# EAGLE schematic LA_16CH (EAGLE 9.2.1)
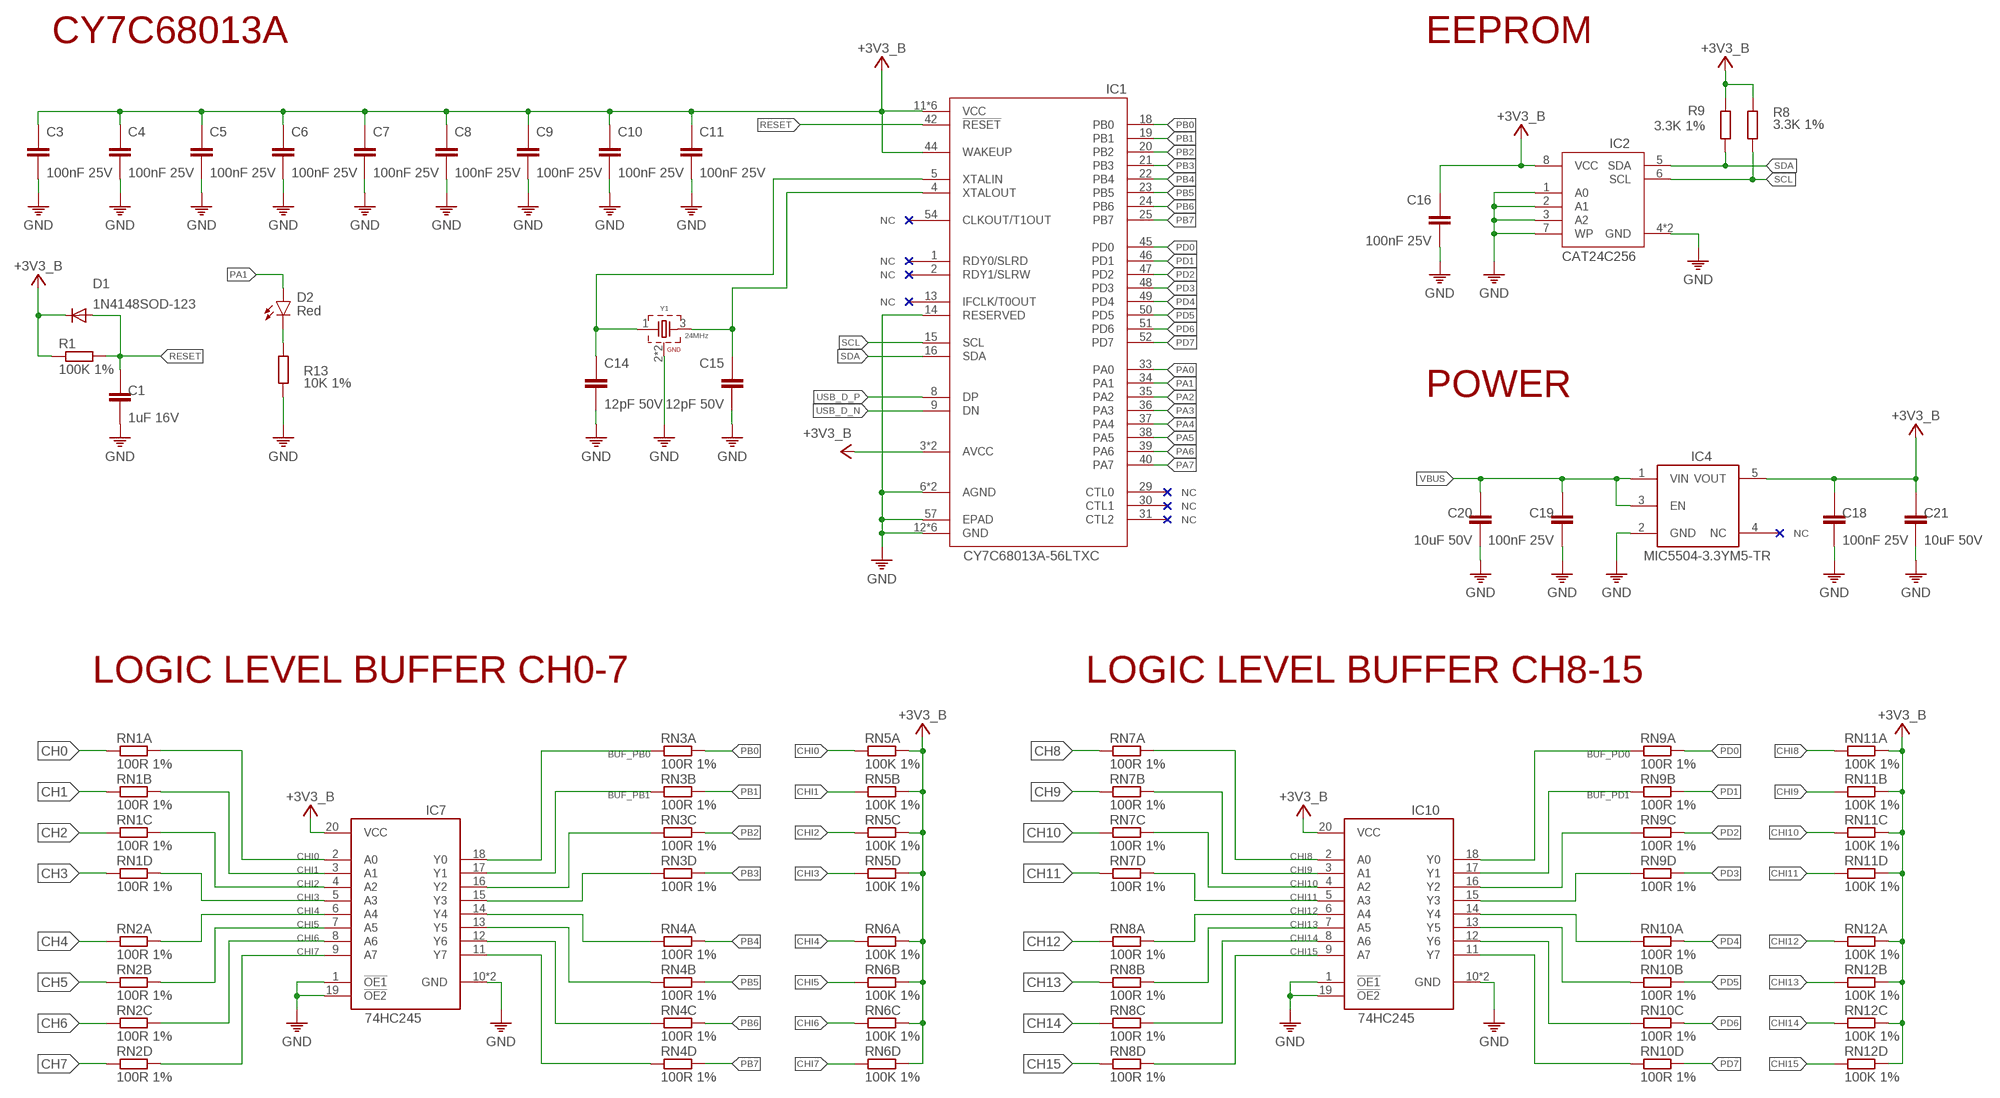
[diagram p0: schematic, sheet 1]

## Parts
C1  1uF 16V  1UF-16V0201  [0201]
C3  100nF 25V  100NF-25V-0201  [0201]
C4  100nF 25V  100NF-25V-0201  [0201]
C5  100nF 25V  100NF-25V-0201  [0201]
C6  100nF 25V  100NF-25V-0201  [0201]
C7  100nF 25V  100NF-25V-0201  [0201]
C8  100nF 25V  100NF-25V-0201  [0201]
C9  100nF 25V  100NF-25V-0201  [0201]
C10  100nF 25V  100NF-25V-0201  [0201]
C11  100nF 25V  100NF-25V-0201  [0201]
C14  12pF 50V  12PF-50V0201  [0201]
C15  12pF 50V  12PF-50V0201  [0201]
C16  100nF 25V  100NF-25V-0201  [0201]
C18  100nF 25V  100NF-25V-0201  [0201]
C19  100nF 25V  100NF-25V-0201  [0201]
C20  10uF 50V  10UF-50V-0805  [0805]
C21  10uF 50V  10UF-50V-0805  [0805]
D1  1N4148SOD-123  DIODE_SOD-123FL  [SOD-123FL]
D2  Red  LED-REDLED-0603  [LED-0603]
IC1  CY7C68013A-56LTXC  CY7C68013A-56QFNLFXC  [QFN50P800X800X100-57T665]
IC2  CAT24C256HU4IGT3  CAT24C256-HU4  [SON50P300X200X50-9T130X140N]
IC4  MIC5504-3.3YM5-TR  [SOT23-5]
IC7  SN74LVC541ARGYR  74LVC541A  [QFN50P350X450X100-25T305X205N]
IC10  SN74LVC541ARGYR  74LVC541A  [QFN50P350X450X100-25T305X205N]
R1  100K 1%  100K-1%0201  [0201]
R8  3.3K 1%  3.3K-1%0201  [0201]
R9  3.3K 1%  3.3K-1%0201  [0201]
R13  10K 1%  10K-1%0603  [0603]
RN1  100R 1%  100R-1%_ARRAY0603X4-1206  [0603X4-1206]
RN2  100R 1%  100R-1%_ARRAY0603X4-1206  [0603X4-1206]
RN3  100R 1%  100R-1%_ARRAY0603X4-1206  [0603X4-1206]
RN4  100R 1%  100R-1%_ARRAY0603X4-1206  [0603X4-1206]
RN5  100K 1%  100K-1%_ARRAY0603X4-1206  [0603X4-1206]
RN6  100K 1%  100K-1%_ARRAY0603X4-1206  [0603X4-1206]
RN7  100R 1%  100R-1%_ARRAY0603X4-1206  [0603X4-1206]
RN8  100R 1%  100R-1%_ARRAY0603X4-1206  [0603X4-1206]
RN9  100R 1%  100R-1%_ARRAY0603X4-1206  [0603X4-1206]
RN10  100R 1%  100R-1%_ARRAY0603X4-1206  [0603X4-1206]
RN11  100K 1%  100K-1%_ARRAY0603X4-1206  [0603X4-1206]
RN12  100K 1%  100K-1%_ARRAY0603X4-1206  [0603X4-1206]
Y1  24MHz  WE-XTAL_CFPX-180_830058149  [WE-XTAL_CFPX-180]

## Nets
+3V3B: C3.1 C4.1 C5.1 C6.1 C7.1 C8.1 C9.1 C10.1 C11.1 C16.1 C18.1 C21.1 D1.C IC1.3(AVCC) IC1.7(AVCC) IC1.11(VCC) IC1.17(VCC) IC1.27(VCC) IC1.32(VCC) IC1.43(VCC) IC1.44(WAKEUP) IC1.55(VCC) IC2.8(VCC) IC4.5(VOUT) IC7.20(VCC) IC10.20(VCC) R1.1 R8.2 R9.2 RN5.A2 RN5.B2 RN5.C2 RN5.D2 RN6.A2 RN6.B2 RN6.C2 RN6.D2 RN11.A2 RN11.B2 RN11.C2 RN11.D2 RN12.A2 RN12.B2 RN12.C2 RN12.D2 ; supply symbol labelled +3V3_B
BUF_PB0: IC7.18(Y0) RN3.A1
BUF_PB1: IC7.17(Y1) RN3.B1
BUF_PB2: IC7.16(Y2) RN3.C1
BUF_PB3: IC7.15(Y3) RN3.D1
BUF_PB4: IC7.14(Y4) RN4.A1
BUF_PB5: IC7.13(Y5) RN4.B1
BUF_PB6: IC7.12(Y6) RN4.C1
BUF_PB7: IC7.11(Y7) RN4.D1
BUF_PD0: IC10.18(Y0) RN9.A1
BUF_PD1: IC10.17(Y1) RN9.B1
BUF_PD2: IC10.16(Y2) RN9.C1
BUF_PD3: IC10.15(Y3) RN9.D1
BUF_PD4: IC10.14(Y4) RN10.A1
BUF_PD5: IC10.13(Y5) RN10.B1
BUF_PD6: IC10.12(Y6) RN10.C1
BUF_PD7: IC10.11(Y7) RN10.D1
CH0: RN1.A1
CH1: RN1.B1
CH2: RN1.C1
CH3: RN1.D1
CH4: RN2.A1
CH5: RN2.B1
CH6: RN2.C1
CH7: RN2.D1
CH8: RN7.A1
CH9: RN7.B1
CH10: RN7.C1
CH11: RN7.D1
CH12: RN8.A1
CH13: RN8.B1
CH14: RN8.C1
CH15: RN8.D1
CHI0: IC7.2(A0) RN1.A2 RN5.A1
CHI1: IC7.3(A1) RN1.B2 RN5.B1
CHI2: IC7.4(A2) RN1.C2 RN5.C1
CHI3: IC7.5(A3) RN1.D2 RN5.D1
CHI4: IC7.6(A4) RN2.A2 RN6.A1
CHI5: IC7.7(A5) RN2.B2 RN6.B1
CHI6: IC7.8(A6) RN2.C2 RN6.C1
CHI7: IC7.9(A7) RN2.D2 RN6.D1
CHI8: IC10.2(A0) RN7.A2 RN11.A1
CHI9: IC10.3(A1) RN7.B2 RN11.B1
CHI10: IC10.4(A2) RN7.C2 RN11.C1
CHI11: IC10.5(A3) RN7.D2 RN11.D1
CHI12: IC10.6(A4) RN8.A2 RN12.A1
CHI13: IC10.7(A5) RN8.B2 RN12.B1
CHI14: IC10.8(A6) RN8.C2 RN12.C1
CHI15: IC10.9(A7) RN8.D2 RN12.D1
GND: C1.2 C3.2 C4.2 C5.2 C6.2 C7.2 C8.2 C9.2 C10.2 C11.2 C14.2 C15.2 C16.2 C18.2 C19.2 C20.2 C21.2 IC1.6(AGND) IC1.10(AGND) IC1.12(GND) IC1.14(RESERVED) IC1.26(GND) IC1.28(GND) IC1.41(GND) IC1.53(GND) IC1.56(GND) IC1.57(EPAD) IC2.1(A0) IC2.2(A1) IC2.3(A2) IC2.4(GND) IC2.7(WP) IC2.9(GND) IC4.2(GND) IC7.1(!OE1) IC7.10(GND) IC7.19(!OE2) IC7.PAD(GND) IC10.1(!OE1) IC10.10(GND) IC10.19(!OE2) IC10.PAD(GND) R13.2 Y1.2(GND) Y1.4(GND)
N$207: D2.C R13.1
PA0: IC1.33(PA0)
PA1: D2.A IC1.34(PA1)
PA2: IC1.35(PA2)
PA3: IC1.36(PA3)
PA4: IC1.37(PA4)
PA5: IC1.38(PA5)
PA6: IC1.39(PA6)
PA7: IC1.40(PA7)
PB0: IC1.18(PB0) RN3.A2
PB1: IC1.19(PB1) RN3.B2
PB2: IC1.20(PB2) RN3.C2
PB3: IC1.21(PB3) RN3.D2
PB4: IC1.22(PB4) RN4.A2
PB5: IC1.23(PB5) RN4.B2
PB6: IC1.24(PB6) RN4.C2
PB7: IC1.25(PB7) RN4.D2
PD0: IC1.45(PD0) RN9.A2
PD1: IC1.46(PD1) RN9.B2
PD2: IC1.47(PD2) RN9.C2
PD3: IC1.48(PD3) RN9.D2
PD4: IC1.49(PD4) RN10.A2
PD5: IC1.50(PD5) RN10.B2
PD6: IC1.51(PD6) RN10.C2
PD7: IC1.52(PD7) RN10.D2
RESET: C1.1 D1.A IC1.42(!RESET) R1.2
SCL: IC1.15(SCL) IC2.6(SCL) R8.1
SDA: IC1.16(SDA) IC2.5(SDA) R9.1
USB_D_N [DIFFPAIR]: IC1.9(DN)
USB_D_P [DIFFPAIR]: IC1.8(DP)
VBUS: C19.1 C20.1 IC4.1(VIN) IC4.3(EN)
XIN: C14.1 IC1.5(XTALIN) Y1.1
XOUT: C15.1 IC1.4(XTALOUT) Y1.3
Unconnected: IC1.1(RDY0/SLRD) IC1.2(RDY1/SLRW) IC1.13(IFCLK/T0OUT) IC1.29(CTL0) IC1.30(CTL1) IC1.31(CTL2) IC1.54(CLKOUT/T1OUT) IC4.4(NC)

## Notes on the sheet
- CY7C68013A | EEPROM
- POWER
- LOGIC LEVEL BUFFER CH0-7 | LOGIC LEVEL BUFFER CH8-15

## Library data of the parts
C1 = ds_capacitors:1UF-16V; DESCRIPTION: 16V 1uF X5R ±20% 0201 Multilayer Ceramic Capacitors MLCC - SMD/SMT ROHS; LCSC_PART: C307385
C3-C11 C16 C18 C19 = ds_capacitors:100NF-25V; DESCRIPTION: 25V 100nF X5R ±10% 0201 Multilayer Ceramic Capacitors MLCC - SMD/SMT ROHS; LCSC_PART: C76939
C14 C15 = ds_capacitors:12PF-50V; DESCRIPTION: 50V 12pF C0G ±5% 0201 Multilayer Ceramic Capacitors MLCC - SMD/SMT ROHS; LCSC_PART: C50391
C20 C21 = ds_capacitors:10UF-50V; DESCRIPTION: 50V 10uF X5R ±10% 0805 Multilayer Ceramic Capacitors MLCC - SMD/SMT ROHS; LCSC_PART: C440198
D1 = adafruit:DIODE: Diode SMADIODE - SMA Surface Mount Package 20V 1A Schottky Diode Digikey: 641-1014-6-ND DO-1N4148 - Through Hole Small Current Diode SOD-123 20V 1 A (.5mV Vf) Schottky Diode - Digikey: MBRX120TPMSCT-ND SOD-323 10V 570mA (.38mV Vf, 3ns) Schottky Diode - Digikey: ZLLS410CT-ND SOD-523 30V 30mA Schottky Diode (RB751S-40TE61) - Digikey: RB751S-40TE61CT-ND SOT23-R/W - SOT23 Package (R = Solder Paste/Reflow Ovens, W = Hand-Soldering) BAT54Film 40V 300mA - Digikey: 497-7162-1-ND
D2 = ds_LED:LED-RED; DESCRIPTION: -40℃~+85℃ Red 0603 LED Indication - Discrete ROHS; LCSC_PART: C2286
IC1 = ds_ic_mcu:CY7C68013A-56QFNLFXC: EZ-USB FX2LP USB Microcontroller High-Speed USB Peripheral Controller
IC2 = ds_ic_memory:CAT24C256: The CAT24C256 is a EEPROM Serial 256−Kb I2C, internally organized as 32,768 words of 8 bits each. It features a 64−byte page write buffer and supports the Standard (100 kHz), Fast (400 kHz) and Fast−Plus (1 MHz) I2C protocol. Write operations can be inhibited by taking the WP pin High (this protects the entire memory). External address pins make it possible to address up to eight CAT24C256 devices on the same bus. On−Chip ECC (Error Correction Code) makes the device suitable for high reliability applications.
IC4 = MCU:MIC5504-3.3YM5-TR
IC7 IC10 = ds_ic_logic:74LVC541: SNx4LVC541A Octal Buffers/Drivers With 3-State Outputs
R1 = ds_resistor:100K-1%; DESCRIPTION: 50mW Thick Film Resistors 25V ±1% ±200ppm/℃ 100kΩ 0201 Chip Resistor - Surface Mount ROHS; LCSC_PART: C270364
R8 R9 = ds_resistor:3.3K-1%; DESCRIPTION: 50mW Thick Film Resistors 25V ±1% ±200ppm/℃ 3.3kΩ 0201 Chip Resistor - Surface Mount ROHS; LCSC_PART: C270350
R13 = ds_resistor:10K-1%; DESCRIPTION: 100mW Thick Film Resistors 75V ±100ppm/℃ ±1% 10kΩ 0603 Chip Resistor - Surface Mount ROHS; LCSC_PART: C25804
RN1-RN4 RN7-RN10 = ds_resistor:100R-1%_ARRAY; DESCRIPTION: 4 ±1% 100Ω 62.5mW ±200ppm/℃ 0603x4 Resistor Networks, Arrays ROHS; LCSC_PART: C136838
RN5 RN6 RN11 RN12 = ds_resistor:100K-1%_ARRAY; DESCRIPTION: 4 ±1% 100kΩ 62.5mW ±200ppm/℃ 0603x4 Resistor Networks, Arrays ROHS; LCSC_PART: C110374
Y1 = Wurth_Quartz Crystals & Oscillators_WE-XTAL:WE-XTAL_CFPX-180: WE-XTAL Quartz Crystal Characteristics SMT and THT models Hermetically sealed Frequencies between 1.8432 MHz and 50 MHz Tolerances down to ±10 ppm available Maximum operating temperatures range: -40 °C to 85 °C Stabilities down to ±10 ppm available Applications Microprocessor Wireless Communication Devices Industrial Devices Wired Communication (e.g. Ethernet and USB) IoT Optical Network Audio and Multimedia Devices Test and Measurement Equipment Navigation and Locators Wearables <https://www.we-online.com/catalog/media/o135919v209%20Family_WE-XTAL_IQXC-42.jpg> Details see: https://www.we-online.com/catalog/en/WE-XTAL Updated by Ella Wu , 2020-11-23 2020 (C) Wurth Elektronik; C-LOAD: 10pF; DATASHEET-URL: https://www.we-online.com/catalog/datasheet/830058149.pdf; MOUNT: SMT; PART-NUMBER: 830058149; STABILITY: 10ppm; TOLERANCE: ±10ppm

## Net classes
1 DIFFPAIR: width 0.2 mm, drill 0.2 mm, clearance 0.1 mm